# EAGLE design Tds_NonSmd_PRINT (EAGLE 9.2.0)
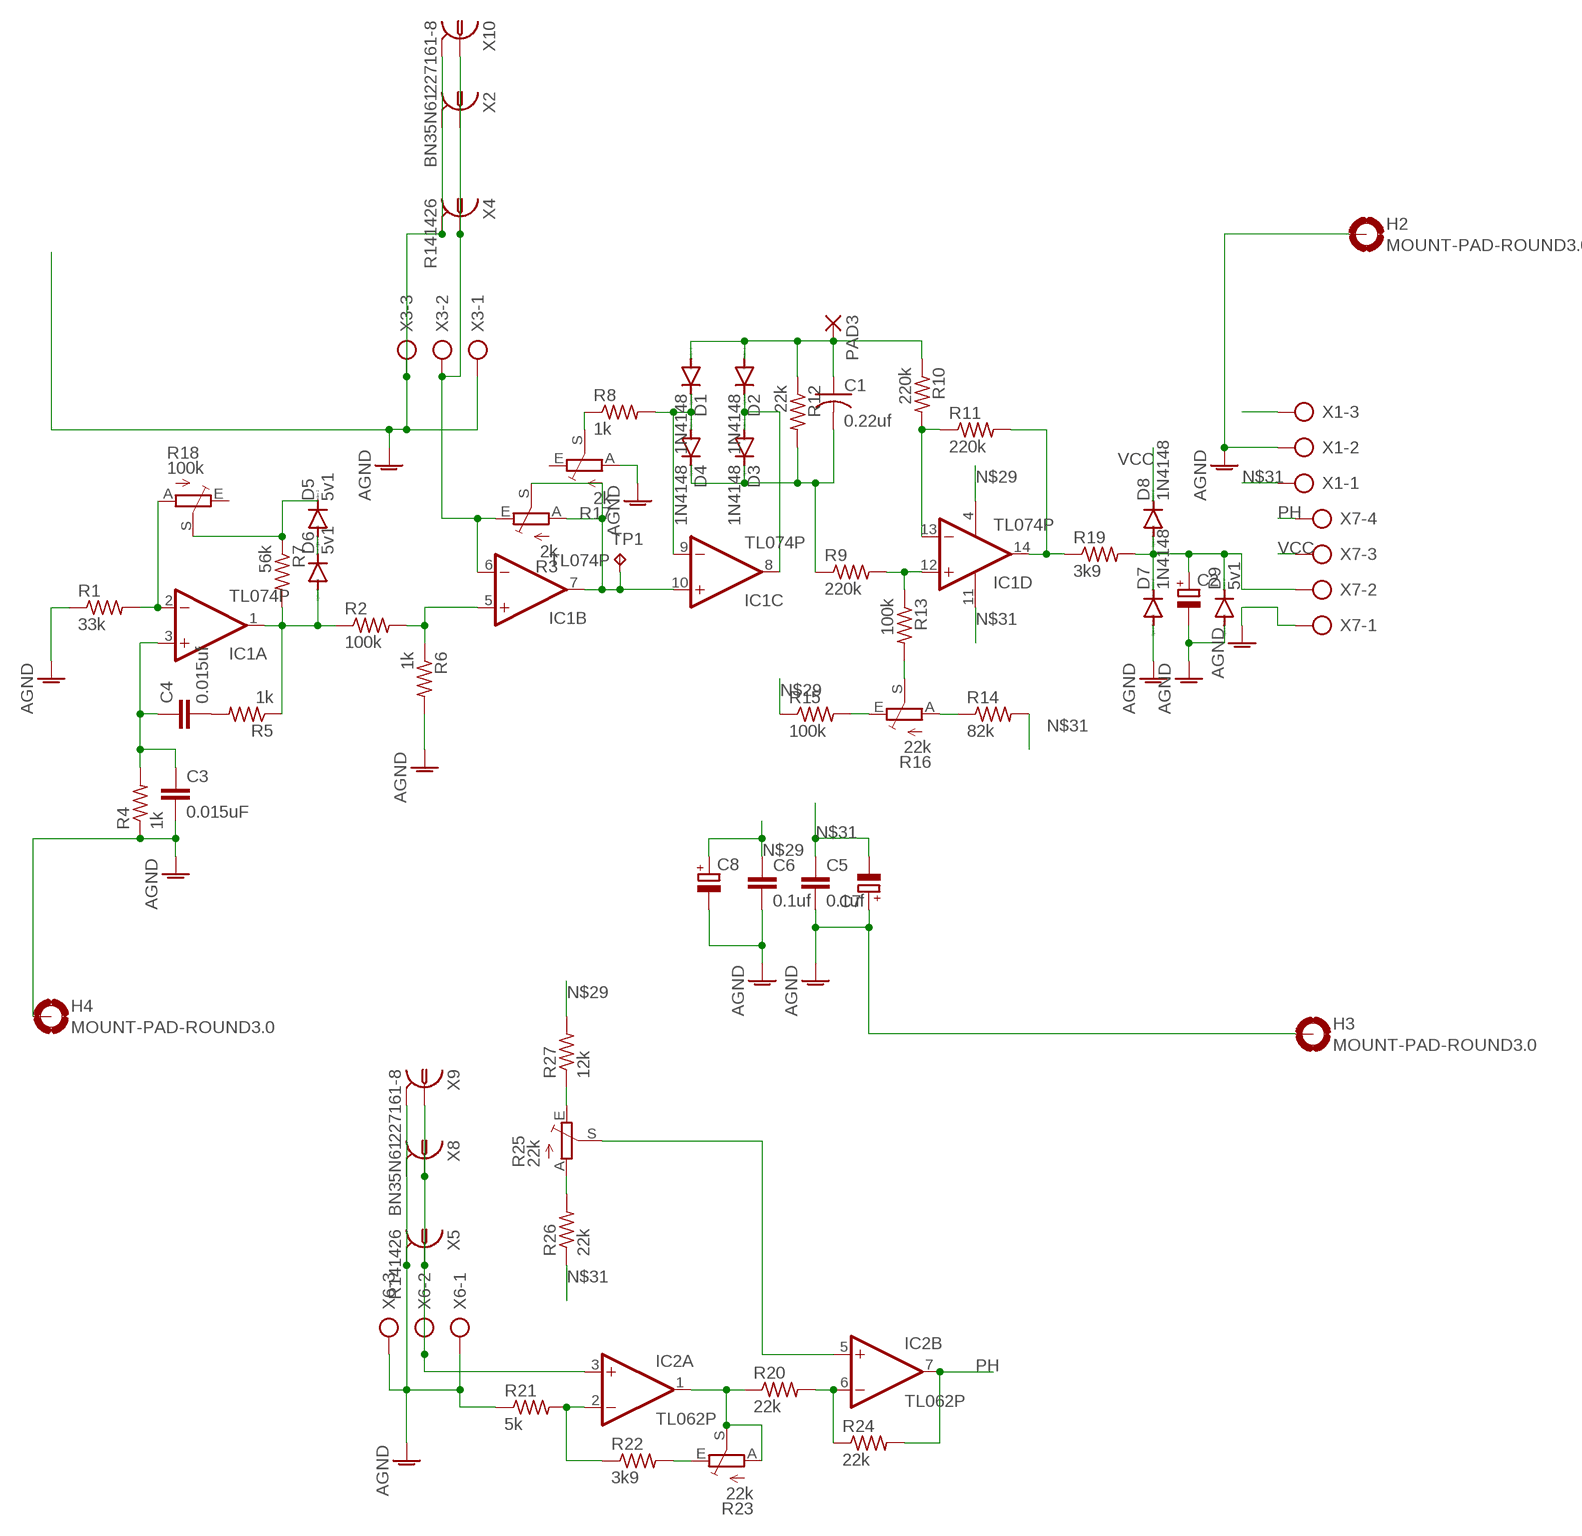
[diagram p0: schematic, sheet 1]

## Parts
C1  0.22uf  C-US050-024X044  [C050-024X044]
C2  CPOL-EUE5-8.5  [E5-8,5]
C3  0.015uF  C-EU050-024X044  [C050-024X044]
C4  0.015uf  C-EU050-024X044  [C050-024X044]
C5  0.1uf  C5/2.5  [C5B2.5]
C6  0.1uf  C5/2.5  [C5B2.5]
C7  CPOL-EUE5-8.5  [E5-8,5]
C8  CPOL-EUE5-8.5  [E5-8,5]
D1  1N4148  1N4148DO35-7  [DO35-7]
D2  1N4148  1N4148DO35-7  [DO35-7]
D3  1N4148  1N4148DO35-7  [DO35-7]
D4  1N4148  1N4148DO35-7  [DO35-7]
D5  5v1  1N4148DO35-7  [DO35-7]
D6  5v1  1N4148DO35-7  [DO35-7]
D7  1N4148  1N4148DO35-7  [DO35-7]
D8  1N4148  1N4148DO35-7  [DO35-7]
D9  5v1  1N4148DO35-7  [DO35-7]
H2  MOUNT-PAD-ROUND3.0  [3,0-PAD]
H3  MOUNT-PAD-ROUND3.0  [3,0-PAD]
H4  MOUNT-PAD-ROUND3.0  [3,0-PAD]
IC1  TL074P  [DIL14]
IC2  TL062P  [DIL08]
PAD3  2,54/1,1  [2,54/1,1]
R1  33k  R-US_0207/7  [0207/7]
R2  100k  R-US_0207/10  [0207/10]
R3  2k  TRIM_EU-S64W  [S64W]
R4  1k  R-US_0207/7  [0207/7]
R5  1k  R-US_0207/7  [0207/7]
R6  1k  R-US_0207/7  [0207/7]
R7  56k  R-US_0207/7  [0207/7]
R8  1k  R-US_0207/7  [0207/7]
R9  220k  R-US_0207/7  [0207/7]
R10  220k  R-US_0207/7  [0207/7]
R11  220k  R-US_0207/7  [0207/7]
R12  22k  R-US_0207/7  [0207/7]
R13  100k  R-US_0207/7  [0207/7]
R14  82k  R-US_0207/7  [0207/7]
R15  100k  R-US_0207/7  [0207/7]
R16  22k  TRIM_EU-S64W  [S64W]
R17  2k  TRIM_EU-S64W  [S64W]
R18  100k  TRIM_EU-S64W  [S64W]
R19  3k9  R-US_0207/7  [0207/7]
R20  22k  R-US_0207/7  [0207/7]
R21  5k  R-US_0207/7  [0207/7]
R22  3k9  R-US_0207/7  [0207/7]
R23  22k  TRIM_EU-S64W  [S64W]
R24  22k  R-US_0207/7  [0207/7]
R25  22k  TRIM_EU-S64W  [S64W]
R26  22k  R-US_0207/7  [0207/7]
R27  12k  R-US_0207/7  [0207/7]
TP1  TPPAD1-13  [P1-13]
X1  AK500/3  [AK500/3]
X2  BN35N61  [B35N61]
X3  AK500/3  [AK500/3]
X4  R141426  [R141426]
X5  R141426  [R141426]
X6  AK500/3  [AK500/3]
X7  AK500/4  [AK500/4]
X8  BN35N61  [B35N61]
X9  227161-8  [AMP_227161]
X10  227161-8  [AMP_227161]

## Nets
AGND: C2.- C3.2 C5.2 C6.2 C7.+ C8.- D7.A D9.A H2.B3,0(MOUNT) H3.B3,0(MOUNT) H4.B3,0(MOUNT) R1.1 R4.1 R6.2 R17.A R21.1 X1.2 X2.2 X2.3 X2.4 X2.5 X3.1 X3.3 X4.2 X4.3 X4.4 X4.5 X5.2 X5.3 X5.4 X5.5 X6.1 X6.3 X7.1 X8.2 X8.3 X8.4 X8.5 X9.2 X10.2
N$1: IC1.2(A:-IN) R1.2 R18.A
N$2: IC1.6(B:-IN) R3.E X2.1 X3.2 X4.1 X10.1
N$3: IC1.5(B:+IN) R2.2 R6.1
N$4: D6.A IC1.1(A:OUT) R2.1 R5.1 R7.2
N$5: C3.1 C4.1 IC1.3(A:+IN) R4.2
N$6: IC2.3(A:+IN) X5.1 X6.2 X8.1 X9.1
N$7: IC1.7(B:OUT) IC1.10(C:+IN) R3.A R3.S TP1.TP
N$8: C4.2 R5.2
N$9: IC1.14(D:OUT) R11.2 R19.1
N$10: C1.1 D1.A D2.A PAD3.1(P) R10.1 R12.1
N$11: D1.C D4.A IC1.9(C:-IN) R8.2
N$12: D2.C D3.A IC1.8(C:OUT)
N$13: IC1.13(D:-IN) R10.2 R11.1
N$14: IC1.12(D:+IN) R9.2 R13.1
N$15: D5.C R7.1 R18.S
N$16: C1.2 D3.C D4.C R9.1 R12.2
N$17: D5.A D6.C
N$18: R13.2 R16.S
N$19: R14.1 R16.A
N$20: R15.2 R16.E
N$21: R8.1 R17.S
N$22: C2.+ D7.C D8.A D9.C R19.2 X7.2
N$23: R25.E R27.1
N$24: IC2.2(A:-IN) R21.2 R22.1
N$25: R25.A R26.2
N$26: IC2.1(A:OUT) R20.1 R23.A R23.S
N$27: R22.2 R23.E
N$28: IC2.6(B:-IN) R20.2 R24.1
N$29: C6.1 C8.+ IC1.4(P:V+) R15.1 R27.2 X1.3
N$30: IC2.5(B:+IN) R25.S
N$31: C5.1 C7.- IC1.11(P:V-) R14.2 R26.1 X1.1
PH: IC2.7(B:OUT) R24.2 X7.4
VCC: D8.C X7.3
Unconnected: R17.E R18.E

## Power pins joined to a net without a drawn wire
N$29: IC2.8(P:V+)
N$31: IC2.4(P:V-)

## Library data of the parts
C1 = rcl:C-US: CAPACITOR, American symbol; SPICEPREFIX: C
C2 C7 C8 = rcl:CPOL-EU: POLARIZED CAPACITOR, European symbol; SPICEPREFIX: C
C3 C4 = rcl:C-EU: CAPACITOR, European symbol; SPICEPREFIX: C
C5 C6 = capacitor-wima:C: CAPACITOR naming: grid - package width
D1-D9 = diode:1N4148: DIODE high speed (Philips)
H2-H4 = holes:MOUNT-PAD-ROUND: MOUNTING PAD, round
IC1 = linear:TL074: OP AMP
IC2 = linear:TL062: OP AMP
PAD3 = wirepad:2,54/1,1: THROUGH-HOLE PAD
R1 R4-R15 R19-R22 R24 R26 R27 = resistor:R-US_: RESISTOR, American symbol
R2 = rcl:R-US_: RESISTOR, American symbol; SPICEPREFIX: R
R3 R16-R18 R23 R25 = pot:TRIM_EU-: POTENTIOMETER
TP1 = testpad:TP: Test pad
X1 X3 X6 = con-ptr500:AK500/3: CONNECTOR; OC_FARNELL: unknown; OC_NEWARK: unknown
X2 X8 = con-coax:BN35N61: BNC CONNECTOR M/A COM www.macom.com distributor Farnell 149-452; OC_FARNELL: unknown; OC_NEWARK: unknown
X4 X5 = con-coax:R141426: BNC COAX CONNECTOR Radiall 50/75 Ohm Spoerle; MF: FARNELL; MPN: R141426161; OC_FARNELL: 4195115; OC_NEWARK: 14J7919
X7 = con-ptr500:AK500/4: CONNECTOR; OC_FARNELL: unknown; OC_NEWARK: unknown
X9 X10 = con-coax:?227161*: JACK, RIGHT ANGLE, 50 OHM, PCB, BNC Source: amp_227161.pdf; OC_FARNELL: unknown; OC_NEWARK: unknown

## Board
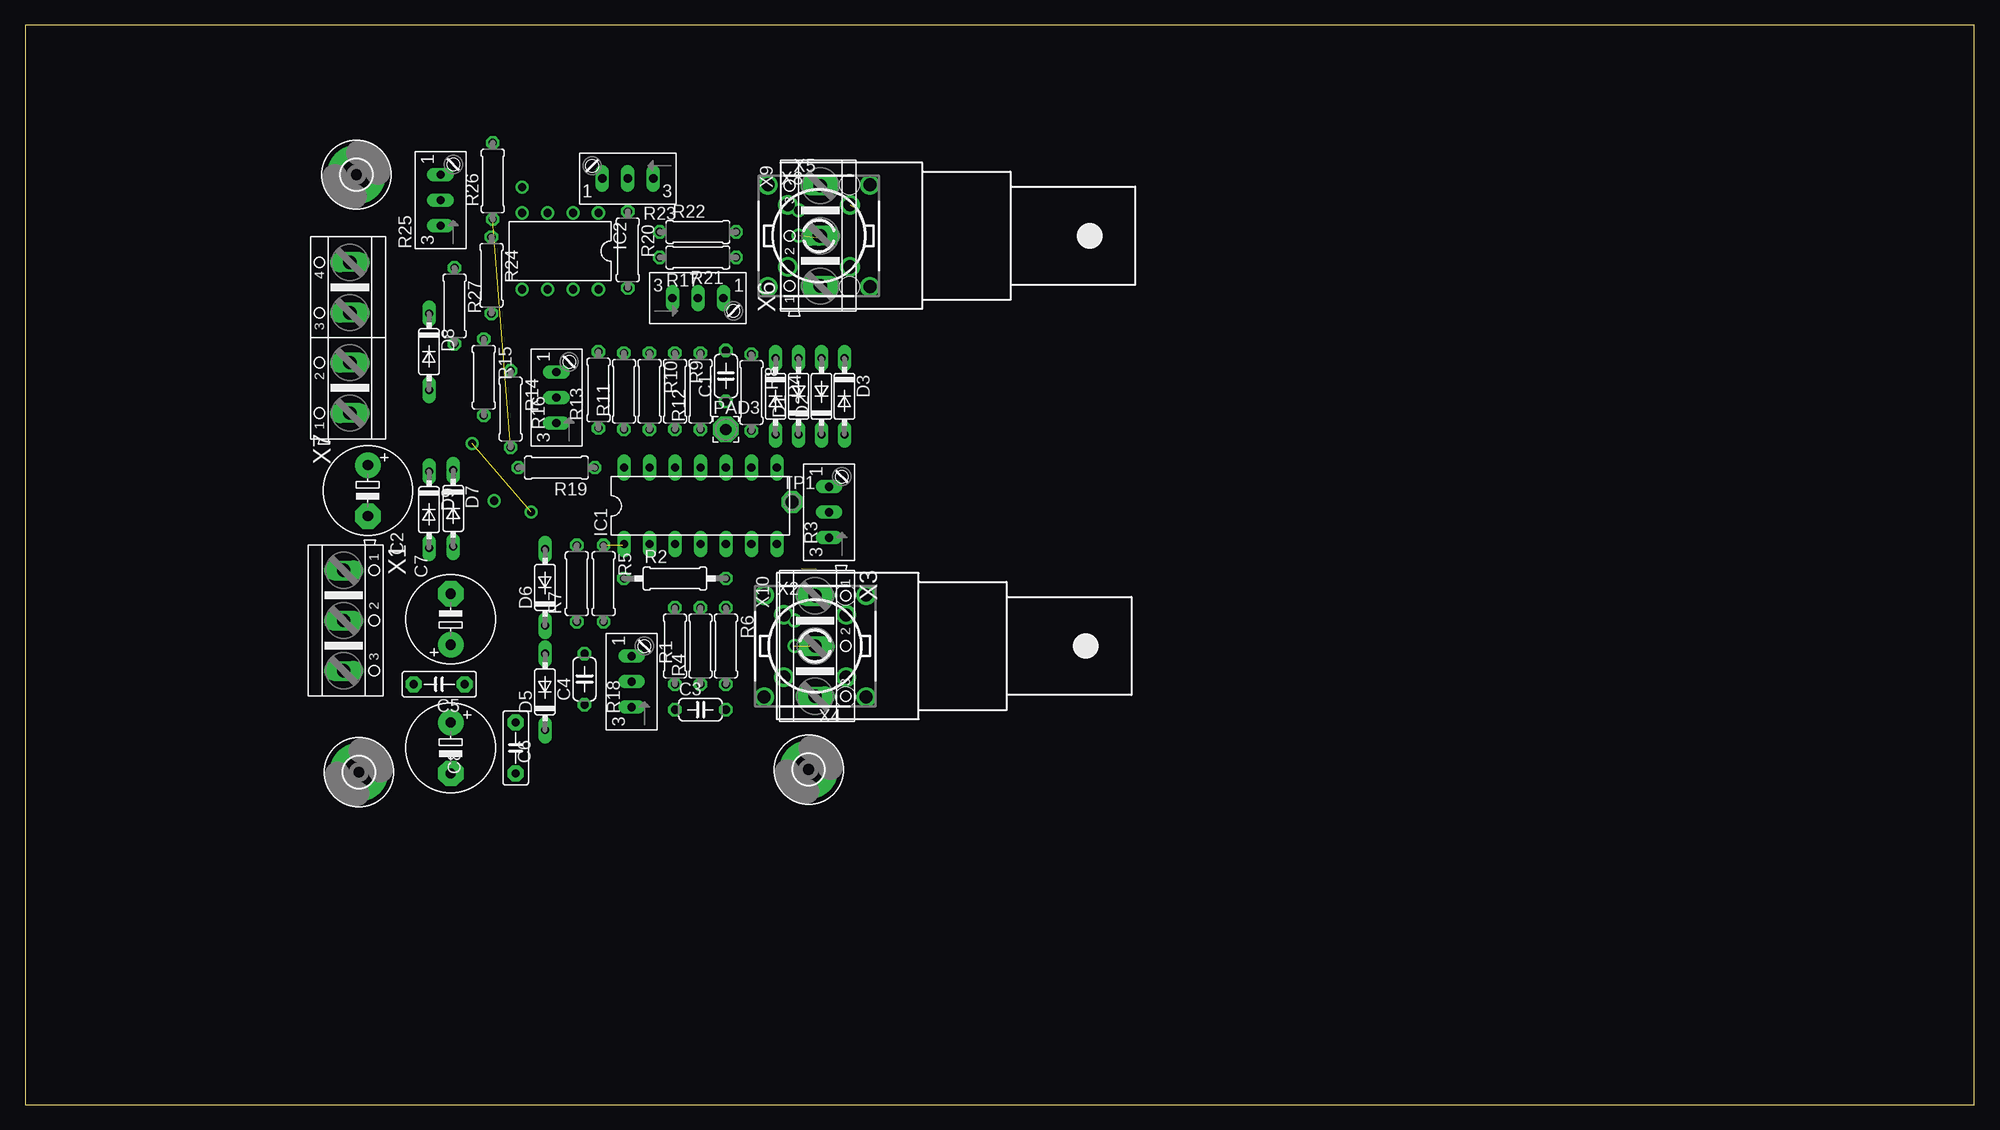
[diagram p1: board, top side]
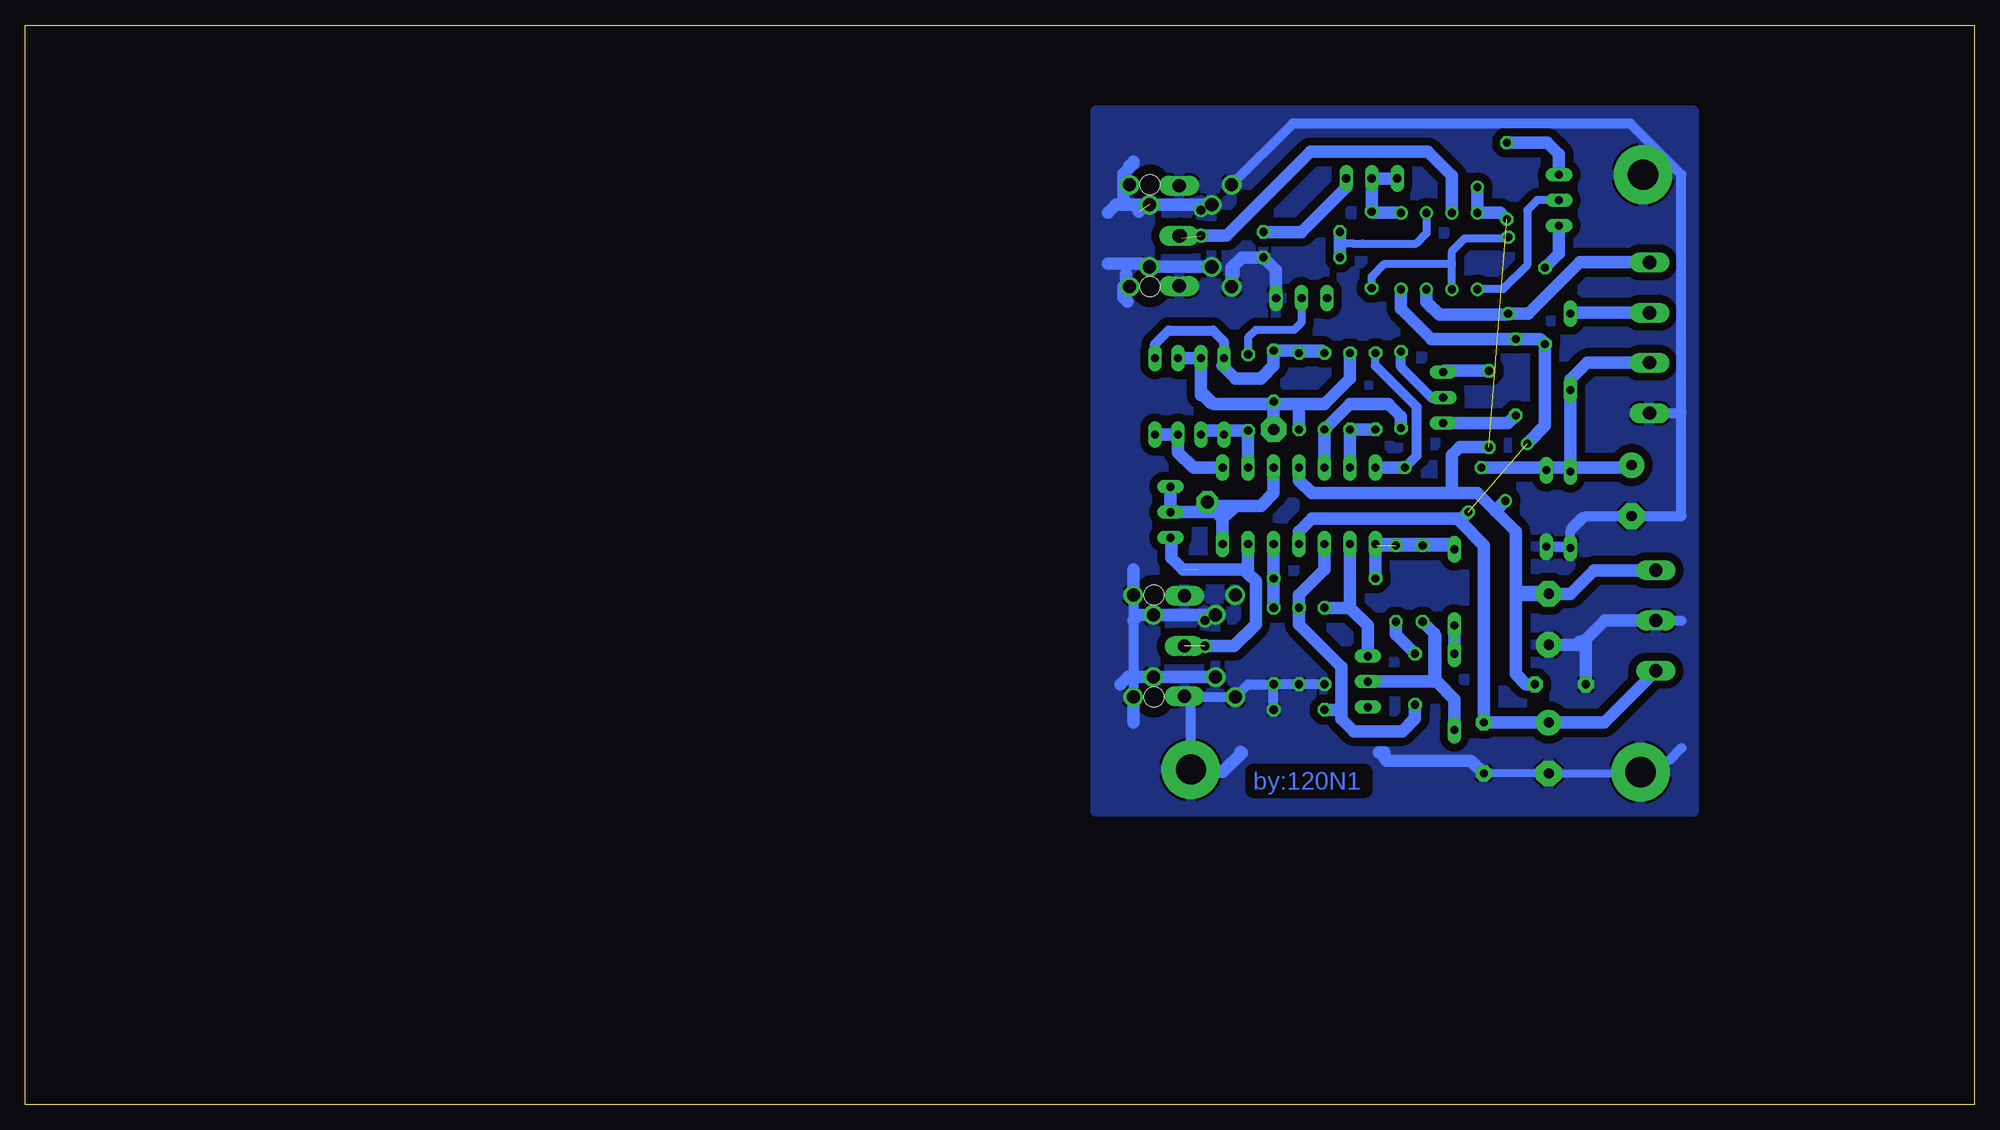
[diagram p2: board, bottom side, seen from below]

Size 194.29 x 107.62 mm. Coordinates in mm from the lower left corner, seen from the top.
Outline: 0,0 194.29,0 194.29,107.62 0,107.62 0,0
Copper layers (1*16): Top 0.035mm / dielectric 1.5mm / Bottom 0.035mm
Design rules "default": minimum track width 6mil, minimum drill 0.35mm, track to track 6mil, track to pad 6mil, pad to pad 6mil, via to via 6mil, smd to smd 6mil, copper to edge 40mil, drill to drill 6mil, minimum pad ring 10mil, minimum via ring 8mil, stop-mask expansion 4mil, vias tented up to drill 0mil, thermal gap 10mil

### Footprints (pad centres in the part's own frame; a part is rotated, then mirrored left to right if it is on the bottom)
C050-024X044 = drill 0.813 octagon: 1 -2.54,0; 2 2.54,0
E5-8,5 = drill 1.016 pad 2.54: + -2.54,0 | drill 1.016 pad 2.54 octagon: - 2.54,0
C5B2.5 = drill 0.813 pad 1.6 octagon: 1 -2.54,0; 2 2.54,0
DO35-7 = drill 0.813 long: A 3.81,0; C -3.81,0
3,0-PAD = drill 3 pad 5.842: B3,0 0,0
DIL14 = drill 0.813 long: 1 -7.62,-3.81; 2 -5.08,-3.81; 3 -2.54,-3.81; 4 0,-3.81; 5 2.54,-3.81; 6 5.08,-3.81; 7 7.62,-3.81; 8 7.62,3.81; 9 5.08,3.81; 10 2.54,3.81; 11 0,3.81; 12 -2.54,3.81; 13 -5.08,3.81; 14 -7.62,3.81
DIL08 = drill 0.813 pad 1.27: 1 -3.81,-3.81; 2 -1.27,-3.81; 3 1.27,-3.81; 4 3.81,-3.81; 5 3.81,3.81; 6 1.27,3.81; 7 -1.27,3.81; 8 -3.81,3.81
2,54/1,1 = drill 1.118 pad 2.54 octagon: 1 0,0
0207/7 = drill 0.813 octagon: 1 -3.81,0; 2 3.81,0
0207/10 = drill 0.813 octagon: 1 -5.08,0; 2 5.08,0
S64W = drill 0.813 long: A 2.54,1.27; E -2.54,1.27; S 0,1.27
P1-13 = drill 1.321 pad 2.159 octagon: TP 0,0
AK500/3 = drill 1.321 long: 1 -5.004,0; 2 0,0; 3 5.004,0
B35N61 = drill 1.2: 1 0,0 | drill 1.3: 2 3.099,3.099; 3 -3.099,3.099; 4 -3.099,-3.099; 5 3.099,-3.099
R141426 = drill 1.295: 1 0,0; 2 5.08,5.08; 3 -5.08,5.08; 4 -5.08,-5.08; 5 5.08,-5.08
AK500/4 = drill 1.321 long: 1 -7.518,0; 2 -2.489,0; 3 2.489,0; 4 7.518,0
AMP_227161 = drill 0.9 pad 1.27: 1 0,-5.08; 2 -2.54,-5.08 | hole 2: -5.08,0; 5.08,0

### Placement (x,y rotation side)
C1  69.85,72.64 90 top
C2  34.16,61.21 270 top
C3  67.31,39.37 0 top
C4  55.75,42.42 90 top
C5  41.27,41.91 180 top
C6  48.89,35.56 270 top
C7  42.42,48.39 90 top
C8  42.42,35.56 270 top
D1  77.09,70.61 90 top
D2  79.38,70.61 90 top
D3  81.66,70.61 270 top
D4  74.8,70.61 270 top
D5  51.82,41.15 90 top
D6  51.82,51.56 90 top
D7  42.67,59.44 270 top
D8  40.26,75.06 270 top
D9  40.26,59.31 270 top
H2  33.27,33.15 0 top
H3  78.1,33.4 0 top
H4  33.02,92.71 0 top
IC1  67.31,59.69 0 top
IC2  53.34,85.09 180 top
PAD3  69.85,67.31 0 top
R1  64.77,45.72 90 top
R2  64.77,52.45 0 top
R3  81.41,59.05 90 top
R4  67.31,45.72 90 top
R5  57.66,51.94 270 top
R6  69.85,45.72 270 top
R7  54.99,51.94 90 top
R8  72.39,70.99 270 top
R9  64.77,71.12 270 top
R10  62.23,71.12 270 top
R11  59.69,71.12 90 top
R12  67.31,71.12 90 top
R13  57.15,71.25 90 top
R14  48.39,69.34 270 top
R15  45.72,72.52 270 top
R16  54.23,70.48 90 top
R17  67.06,79.12 0 top
R18  61.72,42.16 90 top
R19  52.96,63.5 180 top
R20  60.07,85.22 270 top
R21  67.06,84.45 180 top
R22  67.06,87 0 top
R23  60.07,93.6 180 top
R24  46.48,82.68 270 top
R25  42.67,90.17 90 top
R26  46.61,92.08 90 top
R27  42.8,79.63 270 top
TP1  76.45,60.07 0 top
X1  31.75,48.26 270 top
X2  78.74,45.72 0 top
X3  78.74,45.72 270 top
X4  78.74,45.72 180 top
X5  79.12,86.61 0 top
X6  79.25,86.61 90 top
X7  32.38,76.45 90 top
X8  79.12,86.61 0 top
X9  82.17,86.61 270 top
X10  81.79,45.72 270 top

### Tracks (layer width: path | path; a pad name or v marks a point on that pad's centre or on a via)
AGND  (1 unrouted)
  Bottom 0.813: 73.03,84.45 73.66,83.82 73.66,82.55 | C6.2 C8.- 33.4,33.02 H2.B3,0 | C2.- 39.12,58.67 40.26,57.53 40.26,57.15 | 40.26,56.77 D9.A | 77.72,33.02 H3.B3,0 | 30.48,34.29 31.75,33.02
  Bottom 1.016: 73.66,92.08 X5.3 67.94,97.79 34.29,97.79 29.21,92.71 29.21,68.96 | R1.1 R6.2 | R6.2 72.39,41.91 X4.2 78.74,40.64 78.1,40.01 H3.B3,0 77.85,33.15 77.47,33.15 | X4.4 83.82,48.26 X4.3 | C3.2 R6.2 | C2.- 32.89,58.67 | 32.11,68.94 X7.1 29.23,68.94 29.21,68.96 | 29.21,68.96 29.21,58.67 C2.- | 39.37,46.1 38.99,46.1 | 29.21,35.56 30.48,34.29 | X1.2 29.21,48.26 | D7.A 40.39,55.63 D9.A 40.26,57.15 38.73,58.67 C2.-
  Bottom 1.27: X1.2 36.83,48.26 38.73,46.35 | 38.73,46.35 38.99,46.1 | C7.+ 39.12,45.85 | 39.37,46.1 39.12,45.85 | 39.12,45.85 38.73,45.47 C5.2 38.73,46.35 | R17.A 69.6,83.19 R21.1 73.03,84.45 74.04,83.44 X5.4 | C6.2 50.16,34.29 58.55,34.29 58.82,34.57 58.82,35.1 59.36,35.1 | 73.15,35.18 73.03,35.05 74.93,33.15 77.47,33.15 | X2.3 X2.2 83.26,48.82 83.82,48.26 | X2.4 X2.5 84.38,42.62 85.09,41.91 | X4.3 83.82,38.1 | X4.4 83.82,53.34 | 84.2,93.6 83.82,93.98 83.82,93.79 84.82,92.79 84.82,89.98 85.09,89.71 | 83.27,89.04 83.38,89.15 | 85.09,89.71 X8.2 X8.3 | 85.09,89.71 85.55,89.71 86.36,88.9 | X8.4 X8.5 82.53,83.82 86.36,83.82 | X5.5 84.58,81.92 84.58,82.8 | 84.42,80.04 84.82,80.44 84.82,81.53
  pour Bottom (isolate 0.813): 27.94,99.06 87.63,99.06 87.63,29.21 27.94,29.21
N$1
  Bottom 1.27: IC1.2 62.23,49.53 | R1.2 62.23,49.53 | 62.23,49.53 60.45,47.75 R18.A
N$2  (2 unrouted)
  Bottom 1.016: 77.41,53.4 77.22,53.21
  Bottom 1.27: 72.39,52.96 72.77,53.34 78.87,53.34 80.01,54.48 80.01,56.39 R3.E | IC1.6 72.39,52.96 | 72.39,52.96 71.63,52.2 71.63,47.88 73.79,45.72 X2.1
N$3
  Bottom 0.152: R2.2 R6.1
  Bottom 1.27: IC1.5 R6.1
N$4  (1 unrouted)
  Bottom 1.016: 59.56,55.75 R7.2 54.61,55.75 | D6.A 52.2,55.75
  Bottom 1.27: 52.2,55.75 54.61,55.75 59.56,55.75 IC1.1 | R2.1 IC1.1 | IC1.1 52.07,55.88
N$5
  Bottom 1.016: 63.07,43.64 63.07,38.94 | 63.07,38.94 63.07,38.43 | 63.07,38.94 63.5,39.37
  Bottom 1.27: IC1.3 64.77,53.34 67.31,50.8 R4.2 67.31,47.88 63.07,43.64 63.07,38.43 61.85,37.21 57.02,37.21 55.75,38.48 C4.1 | 63.5,39.37 C3.1
N$6  (1 unrouted)
  Bottom 1.016: 78.99,86.36 X6.2
  Bottom 1.27: IC2.3 52.07,92.58 54.48,95 66.17,95 74.55,86.61 X8.1 X6.2
N$7
  Bottom 1.016: 73.66,59.69 74.93,59.69 | 74.93,59.69 76.2,59.69 | 74.93,59.18 74.93,59.69 | TP1.TP 77.47,59.05
  Bottom 1.27: R3.S 76.84,59.05 76.2,59.69 76.45,59.94 TP1.TP 76.07,59.69 74.42,59.69 | 75.56,59.05 77.47,59.05 R3.S | IC1.10 69.85,60.96 71.12,59.69 73.66,59.69 | 73.66,59.69 74.42,59.69 | 74.42,59.69 74.93,59.18 | 74.93,58.42 73.66,59.69 | IC1.7 74.93,58.42 | 74.93,58.42 75.56,59.05 | 74.93,59.18 75.44,59.18 75.56,59.05 | 74.93,59.18 74.93,58.42 | R3.A R3.S
N$8
  Bottom 1.27: R5.2 57.66,46.86 C4.2
N$9
  Bottom 0.813: 59.69,73.66 R11.2 | 55.58,69.55 55.88,69.85
  Bottom 1.016: R19.1 55.58,64.69 55.58,69.55 | 55.88,69.85 59.69,73.66
  Bottom 1.27: IC1.14 R19.1
N$10
  Bottom 1.016: 70.1,69.85 C1.1 | 69.85,69.85 70.1,69.85 | 77.09,70.74 76.2,69.85 70.1,69.85
  Bottom 1.27: 77.09,71.12 D1.A D2.A | 77.09,71.12 77.09,70.74 | 77.09,71.12 75.82,69.85 69.85,69.85 | 69.85,69.85 67.31,69.85 | 67.31,69.85 64.77,69.85 62.23,72.39 R10.1 | R12.1 67.31,69.85 | PAD3.1 69.85,69.85
N$11
  Bottom 0.61: D4.A 75.18,67.18 76.71,67.18
  Bottom 1.27: D1.C 76.71,67.18 R8.2 IC1.9
N$12
  Bottom 1.016: D2.C 79.38,66.04
  Bottom 1.27: IC1.8 77.85,63.5 79.38,65.02 D2.C D3.A
N$13
  Bottom 1.27: IC1.13 R10.2 R11.1
N$14
  Bottom 1.27: IC1.12 R9.2 | 64.77,67.44 R9.2 | R9.2 62.23,69.85 58.42,69.85 57.15,68.58 R13.1
N$15
  Bottom 1.016: R7.1 54.86,48.26 | 53.59,42.16 53.59,46.74 53.85,46.99
  Bottom 1.27: R18.S 53.59,42.16 | 53.59,42.16 53.85,42.42 53.85,46.99 R7.1 | 53.59,42.16 51.82,40.39 D5.C
N$16
  Bottom 1.016: 67.31,75.06 69.72,75.06 C1.2 | R9.1 R12.2 | D3.C 81.66,75.82 80.31,77.17 75.89,77.17 74.8,76.07 D4.C 74.93,74.3 74.93,73.66
  Bottom 1.27: R9.1 65.02,75.18 C1.2 69.85,73.66 71.12,72.39 73.66,72.39 74.93,73.66
N$17
  Bottom 1.27: D5.A D6.C
N$18
  Bottom 1.016: R16.S 54.1,70.48 57.15,73.53 R13.2
N$19
  Bottom 1.27: R16.A 52.83,73.15 R14.1
N$20
  Bottom 0.813: R16.E 52.58,67.94
  Bottom 1.27: R15.2 46.48,67.94 R16.E
N$21
  Bottom 0.813: R17.S 67.06,77.98 67.82,77.22 71.63,77.22 72.39,76.45 R8.1
N$22
  Bottom 0.152: D9.C 40.39,63.25 D7.C
  Bottom 0.813: 40.26,72.26 D8.A
  Bottom 1.016: 36.25,73.97 X7.2
  Bottom 1.27: D8.A 40.26,63.37 | 40.26,63.37 40.39,63.25 | 40.13,63.5 40.26,63.37 | 40.64,63.5 R19.2 | D9.C 40.64,63.5 | D9.C 40.26,63.37 | C2.+ 34.42,63.5 40.64,63.5 | X7.2 38.56,73.97 40.26,72.26 D9.C
N$23
  Bottom 0.813: 41.4,84.84 41.4,85.09
  Bottom 1.27: R27.1 41.4,84.84 | 41.4,85.09 R25.E
N$24
  Bottom 0.813: IC2.2 54.61,86.87 55.63,85.85 60.96,85.85 61.98,85.85 63.12,85.85 63.25,85.72 | 63.12,84.33 R21.2 | 63.25,86.87 R22.1
  Bottom 1.27: R21.2 63.25,85.72 R22.1
N$25
  Bottom 1.27: R25.A 41.4,94.74 42.55,95.89 R26.2
N$26
  Bottom 1.27: R23.A R23.S R20.1 59.94,88.9 IC2.1
N$27
  Bottom 1.27: R23.E 62.61,91.44 67.06,87 R22.2
N$28
  Bottom 0.813: R24.1 46.86,86.49 46.99,86.36 50.8,86.36 52.07,85.09 52.07,83.82 | IC2.6 52.07,83.82 | R20.2 60.07,82.55 58.8,83.82 52.07,83.82
N$29  (via drill 0.8 pad 1.3)  (1 unrouted)
  Bottom 1.016: 48.86,38.14 C6.1 | R15.1 45.59,76.2 | R15.1 54.1,76.33 | R15.1 43.31,76.33 43.18,76.2
  Bottom 1.27: IC1.4 67.31,57.15 66.04,58.42 51.56,58.42 51.31,58.17 | 51.31,58.17 48.89,55.75 C6.1 C8.+ 36.91,38.1 X1.3 | 51.31,58.17 v50.42,59.05 | R27.2 43.18,76.2 | v44.58,65.91 42.8,67.69 R27.2 | R27.2 43.31,76.33 54.1,76.33 57.15,79.38 IC2.8
N$30
  Bottom 0.813: IC2.5 46.99,81.28 44.58,83.69 44.58,89.15 43.56,90.17 R25.S
N$31  (via drill 0.8 pad 1.3)  (1 unrouted)
  Bottom 1.016: 48.51,65.41 R14.2 | C7.- 41.66,50.93 | 45.72,51.18 41.91,51.18 41.66,50.93 | 41.53,50.8 41.66,50.93
  Bottom 1.27: C7.- 42.55,50.8 45.72,50.8 | C5.1 44.7,41.91 45.72,42.93 45.72,50.8 | 45.72,51.18 45.72,57.15 47.75,59.18 | 52.07,60.96 49.53,60.96 47.75,59.18 | 52.07,60.96 66.04,60.96 67.31,62.23 IC1.11 | 45.72,51.18 45.72,50.8 | 47.75,59.18 v46.74,60.2 | v49.53,91.44 IC2.4 47.24,88.9 R26.1 | C7.- 40.26,50.93 37.92,53.26 X1.1 | C7.- 45.47,50.93 45.72,51.18 | R14.2 51.31,65.53 52.07,64.77 52.07,60.96
PH
  Bottom 1.016: R24.2 46.35,78.74 44.45,78.74 44.45,78.87 | 44.45,78.87 39.5,83.82 | 44.45,78.87 44.58,78.74 46.61,78.74
  Bottom 1.27: IC2.7 54.61,80.01 53.34,78.74 46.61,78.74 R24.2 44.45,78.87 39.34,83.97 X7.4
VCC
  Bottom 1.016: 40.18,78.94 D8.C
  Bottom 1.27: X7.3 40.18,78.94

### Text on the board
Bottom: by:120N1